# EAGLE design scu_board (EAGLE 9.3.0)
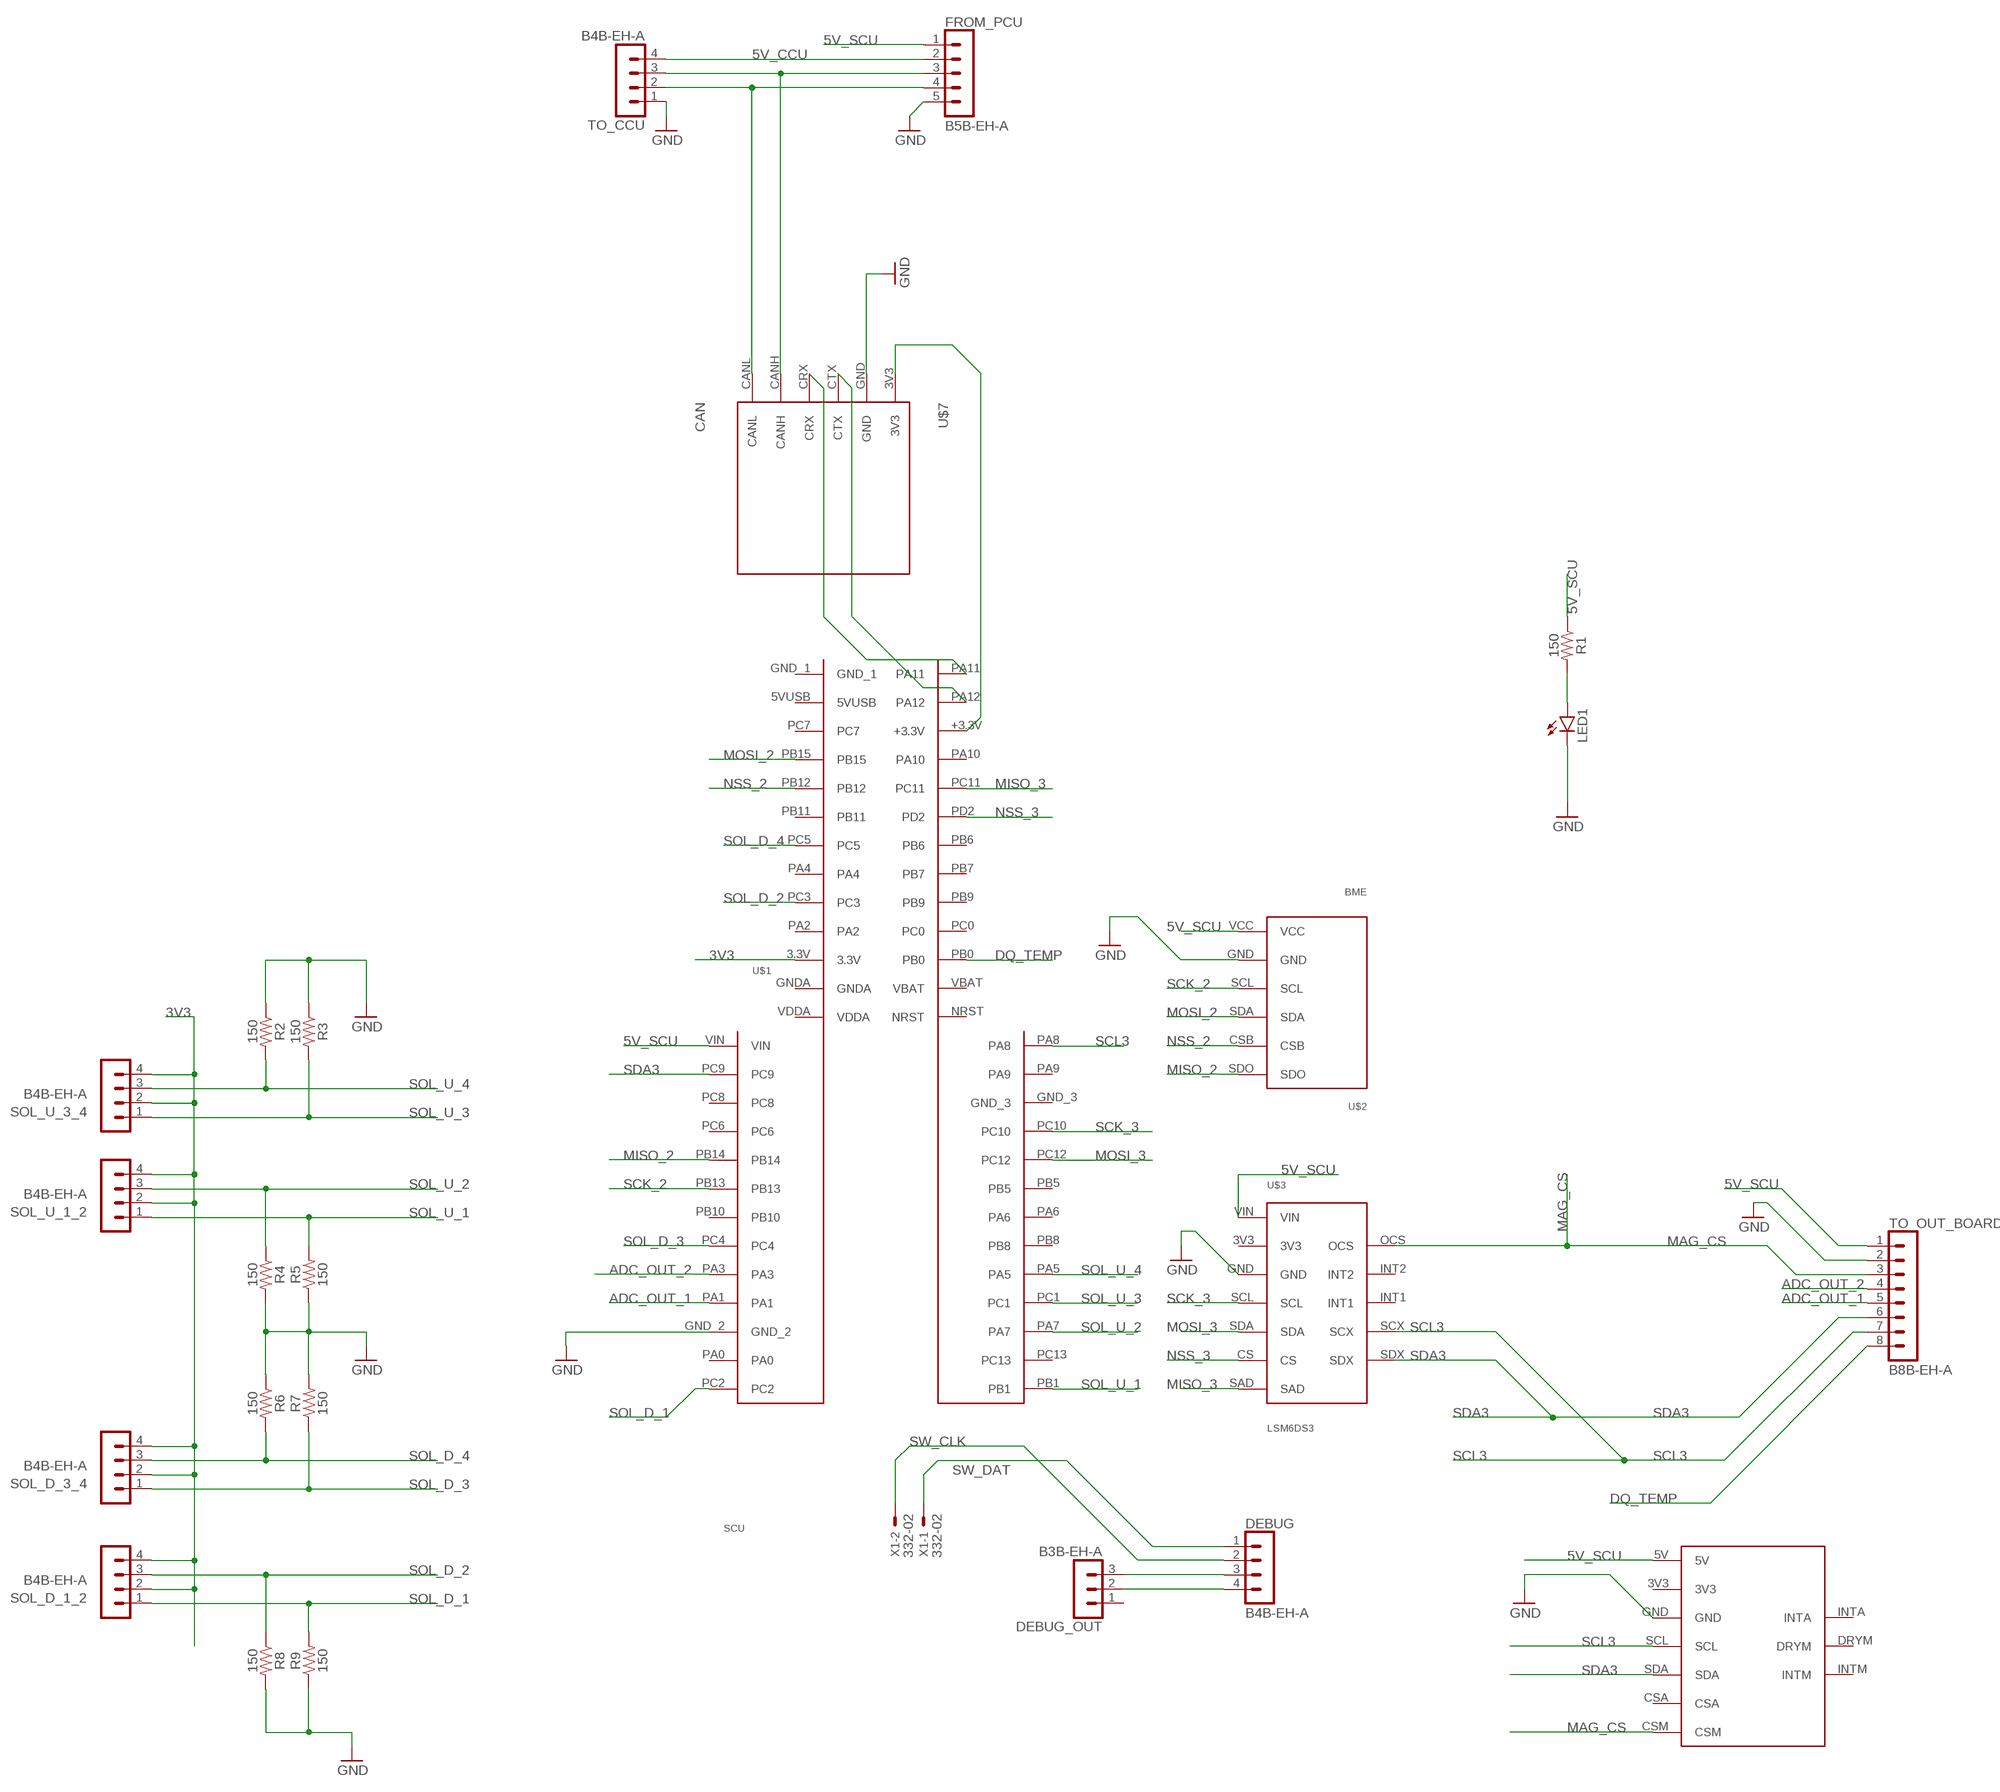
[diagram p0: schematic, sheet 1]

## Parts
DEBUG  B4B-EH-A  [B4B-EH-A]
DEBUG_OUT  B3B-EH-A  [B3B-EH-A]
FROM_PCU  B5B-EH-A  [B5B-EH-A]
LED1  LED5MM  [LED5MM]
R1  150  RESISTORAXIAL-0.3  [AXIAL-0.3]
R2  150  RESISTORAXIAL-0.3  [AXIAL-0.3]
R3  150  RESISTORAXIAL-0.3  [AXIAL-0.3]
R4  150  RESISTORAXIAL-0.3  [AXIAL-0.3]
R5  150  RESISTORAXIAL-0.3  [AXIAL-0.3]
R6  150  RESISTORAXIAL-0.3  [AXIAL-0.3]
R7  150  RESISTORAXIAL-0.3  [AXIAL-0.3]
R8  150  RESISTORAXIAL-0.3  [AXIAL-0.3]
R9  150  RESISTORAXIAL-0.3  [AXIAL-0.3]
SOL_D_1_2  B4B-EH-A  [B4B-EH-A]
SOL_D_3_4  B4B-EH-A  [B4B-EH-A]
SOL_U_1_2  B4B-EH-A  [B4B-EH-A]
SOL_U_3_4  B4B-EH-A  [B4B-EH-A]
TO_CCU  B4B-EH-A  [B4B-EH-A]
TO_OUT_BOARD  B8B-EH-A  [B8B-EH-A]
U$1  SCU  [SCU]
U$2  BME  [BME]
U$3  LSM6DS3  [LSM6DS3]
U$4  LSM303C  [LSM303C]
U$7  CAN  [CAN]
X1  332-02  [332-02]

## Nets
3V3: SOL_D_1_2.2 SOL_D_1_2.4 SOL_D_3_4.2 SOL_D_3_4.4 SOL_U_1_2.2 SOL_U_1_2.4 SOL_U_3_4.2 SOL_U_3_4.4 U$1.3.3V
5V_CCU: FROM_PCU.2 TO_CCU.4
5V_SCU: FROM_PCU.1 R1.P$1 TO_OUT_BOARD.1 U$1.VIN U$2.VCC U$3.VIN U$4.5V
ADC_OUT_1: TO_OUT_BOARD.5 U$1.PA1
ADC_OUT_2: TO_OUT_BOARD.4 U$1.PA3
DQ_TEMP: TO_OUT_BOARD.8 U$1.PB0
GND: FROM_PCU.5 LED1.K(C) R2.P$1 R3.P$1 R4.P$2 R5.P$1 R6.P$1 R7.P$2 R8.P$2 R9.P$1 TO_CCU.1 TO_OUT_BOARD.2 U$1.GND_2 U$2.GND U$3.GND U$4.GND U$7.GND
MAG_CS: TO_OUT_BOARD.3 U$3.OCS U$4.CSM
MISO_2: U$1.PB14 U$2.SDO
MISO_3: U$1.PC11 U$3.SAD
MOSI_2: U$1.PB15 U$2.SDA
MOSI_3: U$1.PC12 U$3.SDA
N$6: U$1.PA11 U$7.CRX
N$7: U$1.PA12 U$7.CTX
N$16: U$1.+3.3V U$7.3V3
N$19: LED1.A R1.P$2
N$23: FROM_PCU.3 TO_CCU.3 U$7.CANH
N$25: FROM_PCU.4 TO_CCU.2 U$7.CANL
N$26: DEBUG.3 DEBUG_OUT.3
N$27: DEBUG.4 DEBUG_OUT.2
NSS_2: U$1.PB12 U$2.CSB
NSS_3: U$1.PD2 U$3.CS
SCK_2: U$1.PB13 U$2.SCL
SCK_3: U$1.PC10 U$3.SCL
SCL3: TO_OUT_BOARD.7 U$1.PA8 U$3.SCX U$4.SCL
SDA3: TO_OUT_BOARD.6 U$1.PC9 U$3.SDX U$4.SDA
SOL_D_1: R9.P$2 SOL_D_1_2.1 U$1.PC2
SOL_D_2: R8.P$1 SOL_D_1_2.3 U$1.PC3
SOL_D_3: R7.P$1 SOL_D_3_4.1 U$1.PC4
SOL_D_4: R6.P$2 SOL_D_3_4.3 U$1.PC5
SOL_U_1: R5.P$2 SOL_U_1_2.1 U$1.PB1
SOL_U_2: R4.P$1 SOL_U_1_2.3 U$1.PA7
SOL_U_3: R3.P$2 SOL_U_3_4.1 U$1.PC1
SOL_U_4: R2.P$2 SOL_U_3_4.3 U$1.PA5
SW_CLK: DEBUG.2 X1.2
SW_DAT: DEBUG.1 X1.1
Unconnected: DEBUG_OUT.1 U$1.5VUSB U$1.GND_1 U$1.GND_3 U$1.GNDA U$1.NRST U$1.PA0 U$1.PA2 U$1.PA4 U$1.PA6 U$1.PA9 U$1.PA10 U$1.PB5 U$1.PB6 U$1.PB7 U$1.PB8 U$1.PB9 U$1.PB10 U$1.PB11 U$1.PC0 U$1.PC6 U$1.PC7 U$1.PC8 U$1.PC13 U$1.VBAT U$1.VDDA U$3.3V3 U$3.INT1 U$3.INT2 U$4.3V3 U$4.CSA U$4.DRYM U$4.INTA U$4.INTM

## Library data of the parts
DEBUG SOL_D_1_2 SOL_D_3_4 SOL_U_1_2 SOL_U_3_4 TO_CCU = con-jst-eh:B4B-EH-A: HEADER
DEBUG_OUT = con-jst-eh:B3B-EH-A: HEADER
FROM_PCU = con-jst-eh:B5B-EH-A: HEADER
LED1 = led:LED: LED OSRAM: - CHIPLED LG R971, LG N971, LY N971, LG Q971, LY Q971, LO R971, LY R971 LH N974, LH R974 LS Q976, LO Q976, LY Q976 LO Q996 - Hyper CHIPLED LW Q18S LB Q993, LB Q99A, LB R99A - SideLED LS A670, LO A670, LY A670, LG A670, LP A670 LB A673, LV A673, LT A673, LW A673 LH A674 LY A675 LS A676, LA A676, LO A676, LY A676, LW A676 LS A679, LY A679, LG A679 - Hyper Micro SIDELED® LS Y876, LA Y876, LO Y876, LY Y876 LT Y87S - SmartLED LW L88C, LW L88S LB L89C, LB L89S, LG L890 LS L89K, LO L89K, LY L89K LS L896, LA L896, LO L896, LY L896 - TOPLED LS T670, LO T670, LY T670, LG T670, LP T670 LSG T670, LSP T670, LSY T670, LOP T670, LYG T670 LG T671, LOG T671, LSG T671 LB T673, LV T673, LT T673, LW T673 LH T674 LS T676, LA T676, LO T676, LY T676, LB T676, LH T676, LSB T676, LW T676 LB T67C, LV T67C, LT T67C, LS T67K, LO T67K, LY T67K, LW E67C LS E67B, LA E67B, LO E67B, LY E67B, LB E67C, LV E67C, LT E67C LW T67C LS T679, LY T679, LG T679 LS T770, LO T770, LY T770, LG T770, LP T770 LB T773, LV T773, LT T773, LW T773 LH T774 LS E675, LA E675, LY E675, LS T675 LS T776, LA T776, LO T776, LY T776, LB T776 LHGB T686 LT T68C, LB T68C - Hyper Mini TOPLED® LB M676 - Mini TOPLED Santana® LG M470 LS M47K, LO M47K, LY M47K Source: http://www.osram.convergy.de LUXEON: - LUMILED® LXK2-PW12-R00, LXK2-PW12-S00, LXK2-PW14-U00, LXK2-PW14-V00 LXK2-PM12-R00, LXK2-PM12-S00, LXK2-PM14-U00 LXK2-PE12-Q00, LXK2-PE12-R00, LXK2-PE12-S00, LXK2-PE14-T00, LXK2-PE14-U00 LXK2-PB12-K00, LXK2-PB12-L00, LXK2-PB12-M00, LXK2-PB14-N00, LXK2-PB14-P00, LXK2-PB14-Q00 LXK2-PR12-L00, LXK2-PR12-M00, LXK2-PR14-Q00, LXK2-PR14-R00 LXK2-PD12-Q00, LXK2-PD12-R00, LXK2-PD12-S00 LXK2-PH12-R00, LXK2-PH12-S00 LXK2-PL12-P00, LXK2-PL12-Q00, LXK2-PL12-R00 Source: www.luxeon.com KINGBRIGHT: KA-3528ASYC Source: www.kingbright.com
R1-R9 = SparkFun-Resistors:RESISTOR: Generic Resistor Package
TO_OUT_BOARD = con-jst-eh:B8B-EH-A: HEADER
U$1 = bluepill:SCU
U$2 = bluepill:BME
U$3 = bluepill:LSM6DS3: lsm
U$4 = bluepill:LSM303C
U$7 = bluepill:CAN
X1 = con-garry:332-02: 2 Pin - 2mm Dual Row Source: www.mpe-connector.de / garry_shortform_2012.pdf

## Board
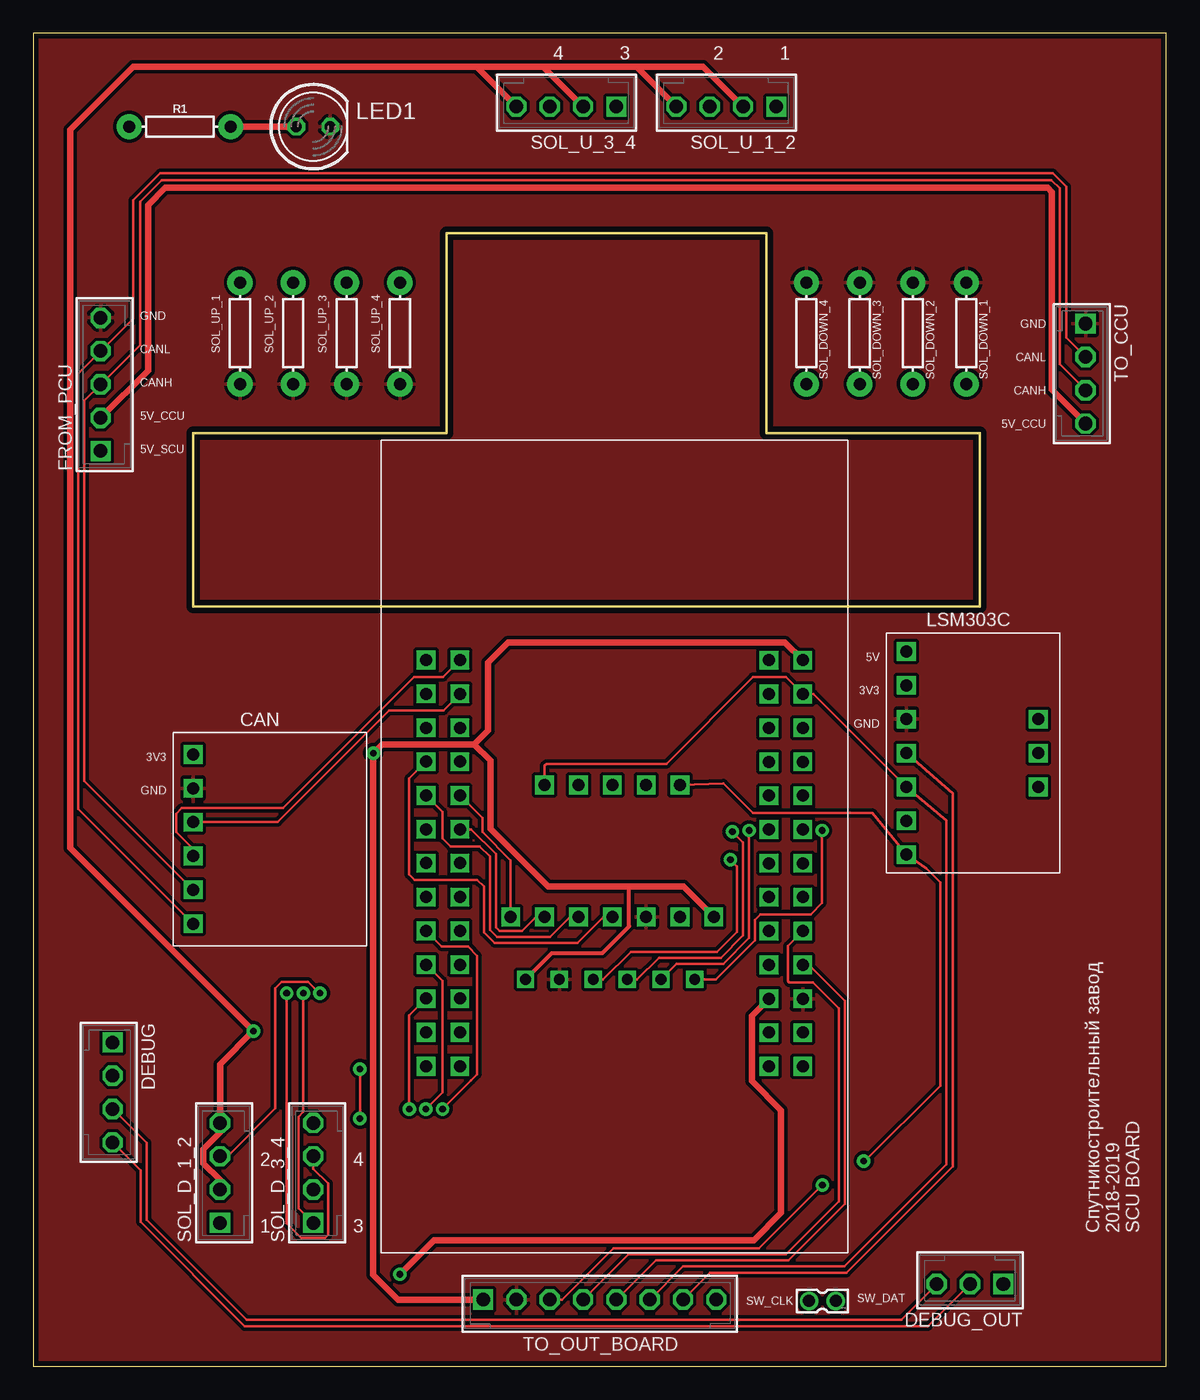
[diagram p1: board, top side]
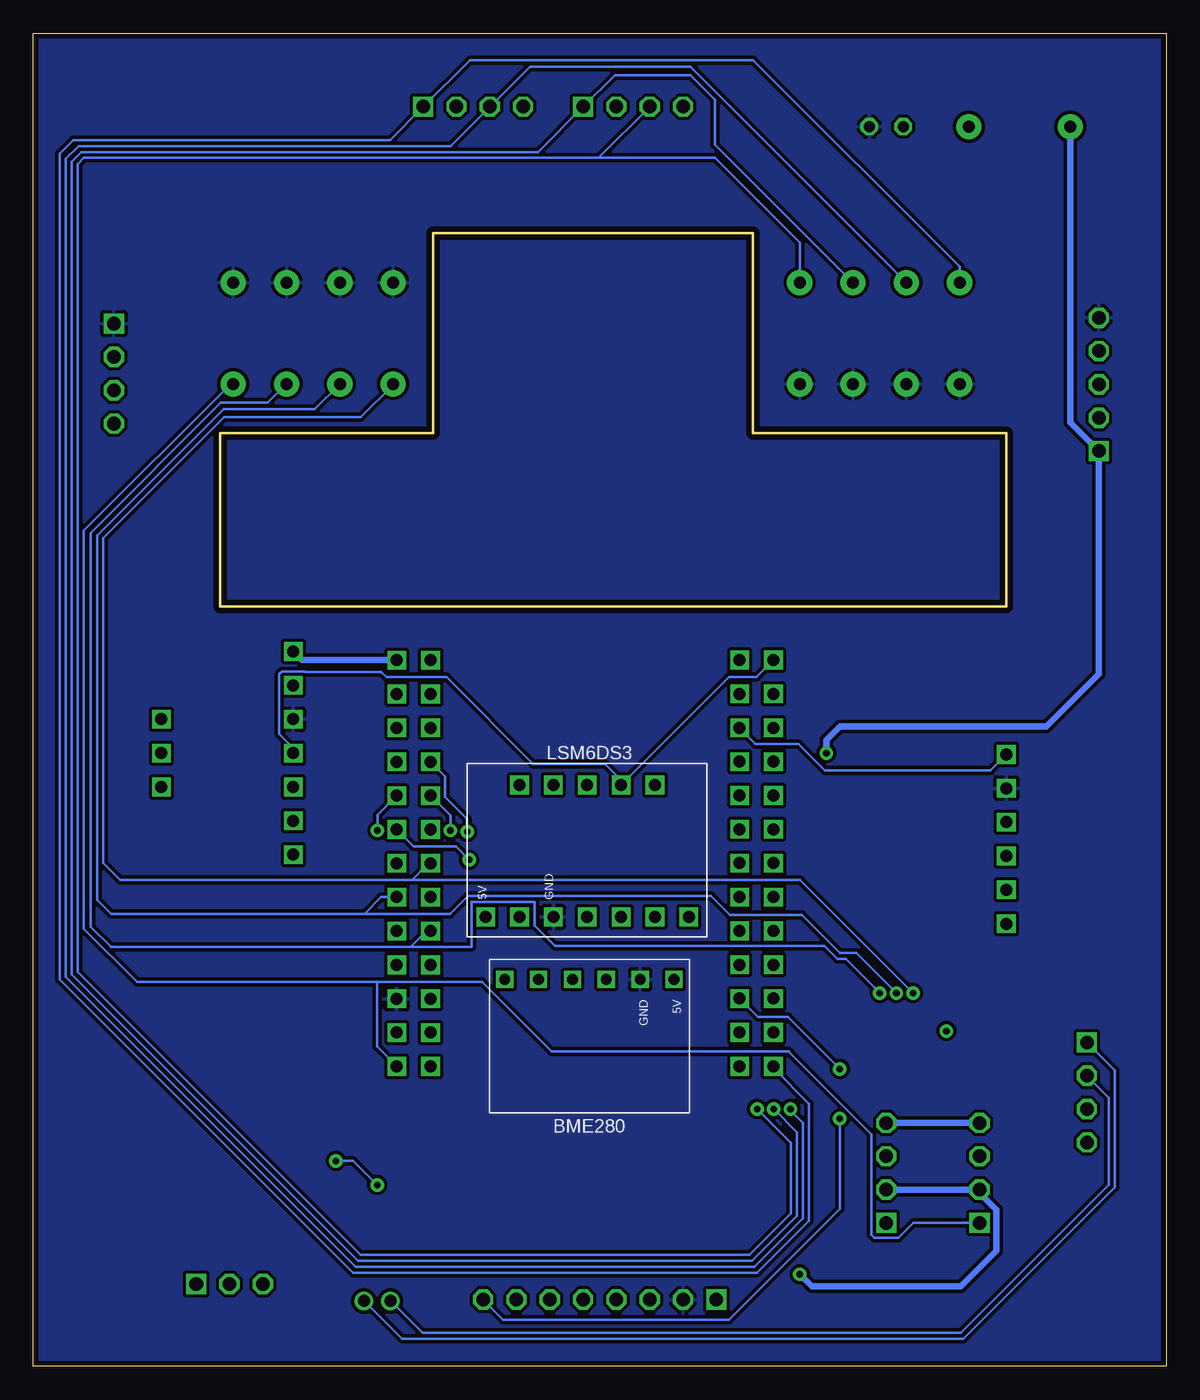
[diagram p2: board, bottom side, seen from below]

Size 85 x 100 mm. Coordinates in mm from the lower left corner, seen from the top.
Outline: 0,0 85,0 85,100 0,100 0,0
Outline: 55,85 31,85 31,70 12,70 12,57 71,57 71,70 55,70 55,85
Copper layers (1*16): Top 0.035mm / dielectric 1mm / Bottom 0.035mm
Design rules "rezonit": minimum track width 0.2mm, minimum drill 0.5mm, track to track 0.25mm, track to pad 0.25mm, pad to pad 0.25mm, via to via 0.25mm, smd to smd 0.2mm, copper to edge 0.4mm, drill to drill 0.4mm, minimum pad ring 0.25mm, minimum via ring 0.25mm, stop-mask expansion 4mil, vias tented up to drill 0.6mm, thermal gap 10mil

### Footprints (pad centres in the part's own frame; a part is rotated, then mirrored left to right if it is on the bottom)
B4B-EH-A = drill 1.016 square: 1 -3.75,0 | drill 1.016 octagon: 2 -1.25,0; 3 1.25,0; 4 3.75,0
B3B-EH-A = drill 1.016 square: 1 -2.5,0 | drill 1.016 octagon: 2 0,0; 3 2.5,0
B5B-EH-A = drill 1.016 square: 1 -5,0 | drill 1.016 octagon: 2 -2.5,0; 3 0,0; 4 2.5,0; 5 5,0
LED5MM = drill 0.813 octagon: A -1.27,0; K 1.27,0
AXIAL-0.3 = drill 0.9 pad 1.88: P$1 -3.81,0; P$2 3.81,0
B8B-EH-A = drill 1.016 square: 1 -8.75,0 | drill 1.016 octagon: 2 -6.25,0; 3 -3.75,0; 4 -1.25,0; 5 1.25,0; 6 3.75,0; 7 6.25,0; 8 8.75,0
SCU = drill 0.9 square: 3.3V 11.59,-11.43; 5VUSB 11.59,11.43; +3.3V -11.59,8.9; GND_1 11.59,13.97; GND_2 14.13,-11.43; GND_3 -14.13,8.9; GNDA 11.59,-13.97; NRST -11.59,-16.5; PA0 14.13,-13.97; PA1 14.13,-8.89; PA2 11.59,-8.89; PA3 14.13,-6.35; PA4 11.59,-3.81; PA5 -14.13,-6.34; PA6 -14.13,-1.26; PA7 -14.13,-11.42; PA8 -14.13,13.98; PA9 -14.13,11.44; PA10 -11.59,6.36; PA11 -11.59,13.98; PA12 -11.59,11.44; PB0 -11.59,-11.42; PB1 -14.13,-16.5; PB5 -14.13,1.28; PB6 -11.59,-1.26; PB7 -11.59,-3.8; PB8 -14.13,-3.8; PB9 -11.59,-6.34; PB10 14.13,-1.27; PB11 11.59,1.27; PB12 11.59,3.81; PB13 14.13,1.27; PB14 14.13,3.81; PB15 11.59,6.35; PC0 -11.59,-8.88; PC1 -14.13,-8.88; PC2 14.13,-16.51; PC3 11.59,-6.35; PC4 14.13,-3.81; PC5 11.59,-1.27; PC6 14.13,6.35; PC7 11.59,8.89; PC8 14.13,8.89; PC9 14.13,11.43; PC10 -14.13,6.36; PC11 -11.59,3.82; PC12 -14.13,3.82; PC13 -14.13,-13.96; PD2 -11.59,1.28; VBAT -11.59,-13.96; VDDA 11.59,-16.51; VIN 14.13,13.97
BME = drill 0.8 square: CSB 4.25,3.81; GND 4.25,-3.81; SCL 4.25,-1.27; SDA 4.25,1.27; SDO 4.25,6.35; VCC 4.25,-6.35
LSM6DS3 = drill 0.9 square: 3V3 -5,5.08; CS -5,-5.08; GND -5,2.54; INT1 4.9,0; INT2 4.9,2.54; OCS 4.9,5.08; SAD -5,-7.62; SCL -5,0; SCX 4.9,-2.54; SDA -5,-2.54; SDX 4.9,-5.08; VIN -5,7.62
LSM303C = drill 0.9 square: 3V3 -5,5.08; 5V -5,7.62; CSA -5,-5.08; CSM -5,-7.62; DRYM 4.9,0; GND -5,2.54; INTA 4.9,2.54; INTM 4.9,-2.54; SCL -5,0; SDA -5,-2.54
CAN = drill 0.9 square: 3V3 -5.75,6.35; CANH -5.75,-3.81; CANL -5.75,-6.35; CRX -5.75,-1.27; CTX -5.75,1.27; GND -5.75,3.81
332-02 = drill 0.9 pad 1.27: 1 0,-1; 2 0,1

### Placement (x,y rotation side)
DEBUG  5.95,20.54 270 top
DEBUG_OUT  70.28,6.16 180 top
FROM_PCU  5.05,73.66 90 top
LED1  21,93 0 top
R1  11,93 0 top
R2  27.5,77.5 90 top
R3  23.5,77.5 90 top
R4  19.5,77.5 270 top
R5  15.5,77.5 90 top
R6  58,77.5 270 top
R7  62,77.5 90 top
R8  66,77.5 90 top
R9  70,77.5 270 top
SOL_D_1_2  14,14.5 90 top
SOL_D_3_4  21,14.5 90 top
SOL_U_1_2  52,94.5 180 top
SOL_U_3_4  40,94.5 180 top
TO_CCU  78.95,74.47 270 top
TO_OUT_BOARD  42.5,5 0 top
U$1  43.6,39 0 top
U$2  43.28,24.77 90 bottom
U$3  43.44,38.71 90 bottom
U$4  70.5,46 0 top
U$7  17.74,39.55 0 top
X1  59.2,4.9 90 top

### Tracks (layer width: path | path; a pad name or v marks a point on that pad's centre or on a via)
3V3  (via drill 0.5)
  Top 0.5: 33.25,97.5 7.5,97.5 2.77,92.78 2.77,38.87 v16.5,25.14 14,22.64 SOL_D_1_2.4 14,17.54 12.74,16.27 12.74,15.23 14,13.96 SOL_D_1_2.2 | 33.25,97.5 38.25,97.5 | 38.25,97.5 45.25,97.5 | 45.25,97.5 50.25,97.5 SOL_U_1_2.2 | SOL_U_3_4.4 33.25,97.5 | SOL_U_3_4.2 38.25,97.5 | SOL_U_1_2.4 45.25,97.5 | v27.5,6.9 30.05,9.45 54.05,9.45 56.1,11.5 56.1,19.2 53.9,21.4 53.9,26.28 U$1.3.3V
  Bottom 0.5: SOL_D_1_2.4 SOL_D_3_4.4 | SOL_D_3_4.2 SOL_D_1_2.2 14,12.98 12.74,11.72 12.74,8.66 15.4,6 26.6,6 v27.5,6.9
5V_CCU
  Top 0.5: FROM_PCU.2 8.6,74.71 8.6,87.11 9.88,88.4 76.1,88.4 76.4,88.1 76.4,73.27 TO_CCU.4
5V_SCU  (via drill 0.5)
  Top 0.3: U$2.VCC 38.91,31 42.7,31 44.7,33 44.7,35.9 44.8,36
  Top 0.5: U$3.VIN 48.77,36 44.8,36 38.61,36 34.29,40.32 34.29,45.45 33.08,46.66 | 33.08,46.66 26.16,46.66 v25.5,46 25.5,6.85 27.35,5 TO_OUT_BOARD.1 | U$1.VIN 56.4,54.3 35.6,54.3 34.1,52.8 34.1,47.68 33.08,46.66
  Bottom 0.5: R1.P$1 7.19,70.8 FROM_PCU.1 5.05,51.95 9,48 24.49,48 25.5,46.99 v25.5,46 | U$4.5V 64.85,52.97 U$1.VIN
ADC_OUT_1
  Top 0.2: TO_OUT_BOARD.5 46.7,7.95 56.65,7.95 60.9,12.2 60.9,27.4 58.19,30.11 U$1.PA1
ADC_OUT_2
  Top 0.2: TO_OUT_BOARD.4 44.65,8.4 56.46,8.4 60.45,12.39 60.45,26.85 58.5,28.8 56.7,28.8 56.6,28.9 56.6,31.52 U$1.PA3
DQ_TEMP  (via drill 0.5)
  Top 0.2: v24.5,18.57 v24.5,22.3
  Bottom 0.2: TO_OUT_BOARD.8 49.75,3.5 32.8,3.5 24.5,11.8 v24.5,18.57 | v24.5,22.3 28.4,26.2 30.63,26.2 U$1.PB0
GND
  pour Bottom: 0,100 0,0 85,0 85,100
  pour Top: 0,100 0,0 85,0 85,100
MAG_CS  (via drill 0.5)
  Top 0.2: U$3.OCS 51.79,43.71 54,41.5 62.95,41.5 U$4.CSM 67,37.36 68.05,36.31 68.05,21.05 62.4,15.4 v62.3,15.4 | TO_OUT_BOARD.3 39.68,5 43.53,8.85 54.45,8.85 v59.2,13.6
  Bottom 0.2: v59.2,13.6 61,15.4 v62.3,15.4
MISO_2  (via drill 0.5)
  Top 0.2: U$2.SDO 51.22,29.02 54.14,31.94 54.14,33.49 54.55,33.9 58.34,33.9 59.18,34.74 v59.18,40.2
  Bottom 0.2: v59.18,40.2 59.18,41.36 U$1.PB14
MISO_3
  Top 0.2: U$3.SAD 35.82,37.94 33.69,40.07 33.69,41.14 U$1.PC11
MOSI_2  (via drill 0.5)
  Top 0.2: U$2.SDA 45.3,29.02 46.92,30.65 51.58,30.65 53.24,32.31 53.24,39.31 v52.45,40.1
  Bottom 0.2: v52.45,40.1 52.45,41.05 54.1,42.7 54.1,44.26 U$1.PB15
MOSI_3
  Top 0.2: U$3.SDA 40.26,33.71 38.76,32.21 34.79,32.21 34.25,32.75 34.25,38.24 33.49,39 31.3,39 30.7,39.6 30.7,41.59 U$1.PC12
N$6
  Top 0.2: U$7.CRX 11.99,38.81 10.7,40.1 10.7,41.42 11.14,41.87 18.73,41.87 28.56,51.7 30.73,51.7 U$1.PA11
N$7
  Top 0.2: U$7.CTX 18.32,40.82 26.7,49.2 30.77,49.2 U$1.PA12
N$16
  Bottom 0.2: U$1.+3.3V 30.81,46.7 27.6,46.7 25.6,44.7 13.19,44.7 U$7.3V3
N$19
  Top 0.5: R1.P$2 LED1.A
N$23
  Top 0.2: TO_CCU.3 77,75.17 77,88.36 76.36,89 9.64,89 8,87.36 8,76.61 FROM_PCU.3 3.83,72.44 3.83,43.91 U$7.CANH
N$25
  Top 0.2: TO_CCU.2 77.5,77.17 77.5,88.5 76.5,89.5 9.5,89.5 7.5,87.5 7.5,78.61 FROM_PCU.4 3.38,74.48 3.38,41.81 U$7.CANL
N$26
  Top 0.2: DEBUG_OUT.3 65.12,3.5 16,3.5 8.5,11 8.5,16.74 DEBUG.3
N$27
  Top 0.2: DEBUG_OUT.2 67.12,3 15.86,3 8.05,10.81 8.05,14.69 DEBUG.4
NSS_2  (via drill 0.5)
  Top 0.2: U$2.CSB 48.27,30.2 51.76,30.2 53.69,32.13 53.69,35.5 53.69,35.59 v53.69,40.19 v53.7,40.2
  Bottom 0.2: v53.7,40.2 53.7,41.32 U$1.PB12
NSS_3
  Top 0.2: U$3.CS 37.72,33.71 36.66,32.66 34.98,32.66 34.7,32.94 34.7,38.42 32.84,40.28 U$1.PD2
SCK_2  (via drill 0.5)
  Top 0.2: U$2.SCL 42.76,29.02 44.84,31.1 51.3,31.1 52.79,32.59 52.79,37.51 v52.3,38
  Bottom 0.2: v52.3,38 53.3,39 56.46,39 U$1.PB13
SCK_3
  Top 0.2: U$3.SCL 42.8,33.71 40.84,31.76 34.6,31.76 33.8,32.56 33.8,36 33.3,36.5 28.6,36.5 28.2,36.9 28.2,44.09 U$1.PC10
SCL3
  Top 0.2: TO_OUT_BOARD.7 50.75,7 61,7 69,15 69,42.98 U$4.SCL
  Bottom 0.2: U$4.SCL 65.5,46.4 66.55,47.45 66.55,51.92 66.34,52.13 64.66,52.13 64.62,52.1 58.9,52.1 58.5,51.7 54,51.7 47.5,45.2 42.1,45.2 40.9,44 U$3.SCX 32.81,51.7 30.75,51.7 U$1.PA8
SDA3
  Top 0.2: TO_OUT_BOARD.6 48.75,7.5 60.86,7.5 68.5,15.14 68.5,40.94 U$4.SDA | 65.26,43.5 U$4.SDA | U$4.SDA 58.53,50.43 U$1.PC9 56.46,51.7 54,51.7 47.5,45.2 38.5,45.2 38.36,45.06 U$3.SDX
SOL_D_1
  Bottom 0.2: SOL_D_1_2.1 18.98,10.75 20.09,9.64 21.91,9.64 22.11,9.84 22.11,17.39 28.32,23.6 28.32,23.62 46.12,23.62 51.35,28.85 59.23,28.85 | 59.23,28.85 77.22,28.85 81.2,32.83 81.2,62.69 70.2,73.69 R9.P$2 | 59.23,28.85 59.23,23.98 U$1.PC2
SOL_D_2  (via drill 0.5)
  Top 0.2: SOL_D_1_2.3 14.57,15.75 18.15,19.33 18.15,28.35 18.65,28.85 20.6,28.85 21.45,28 v21.5,28
  Bottom 0.2: v21.5,28 24.05,30.55 24.69,30.55 25.66,31.52 45.85,31.52 47.4,33.08 47.4,34.85 52.12,34.85 52.12,31.45 56.7,31.45 | R8.P$1 67.4,72.29 70.94,72.29 80.7,62.52 80.7,32.98 79.17,31.45 56.7,31.45 | 56.7,31.45 55.5,32.65 U$1.PC3
SOL_D_3  (via drill 0.5)
  Top 0.2: v20.25,28 20.25,19.07 19.89,18.71 19.89,11.86 SOL_D_3_4.1
  Bottom 0.2: v20.25,28 23.25,31 24.5,31 27.35,33.85 32.71,33.85 34.16,35.3 52.4,35.3 53.75,33.95 60.15,33.95 | R7.P$1 63.9,71.79 70.73,71.79 80.2,62.33 80.2,35 79.15,33.95 60.15,33.95 | 60.15,33.95 58.91,35.19 U$1.PC4
SOL_D_4  (via drill 0.5)
  Top 0.2: SOL_D_3_4.3 21,14.82 22.11,13.71 22.11,9.84 21.91,9.64 20.09,9.64 19,10.73 v19,28
  Bottom 0.2: v19,28 27.5,36.5 56.6,36.5 | R6.P$2 58,73.62 60.43,71.19 70.69,71.19 79.75,62.14 79.75,37.75 78.5,36.5 56.6,36.5 | 56.6,36.5 55.37,37.73 U$1.PC5
SOL_U_1
  Bottom 0.2: R5.P$2 15.5,82.5 31,98 52.25,98 SOL_U_1_2.1 58.25,92 82,92 83.03,90.97 83.03,29.02 61.01,7 30.7,7 26.8,10.9 26.8,19.7 29.47,22.37 U$1.PB1
SOL_U_2  (via drill 0.5)
  Top 0.2: v28.2,19.3 28.2,26.31 U$1.PA7
  Bottom 0.2: R4.P$1 35.69,97.5 47.75,97.5 SOL_U_1_2.3 53.7,91.55 81.6,91.55 82.58,90.58 82.58,29.2 60.82,7.45 30.9,7.45 27.25,11.1 27.25,18.25 28.2,19.2 v28.2,19.3
SOL_U_3  (via drill 0.5)
  Top 0.2: v29.45,19.3 30.7,20.55 30.7,28.89 U$1.PC1
  Bottom 0.2: R3.P$2 33.84,91.66 33.84,95.02 35.7,96.88 41.38,96.88 SOL_U_3_4.1 47.15,91.1 81.4,91.1 82.12,90.38 82.12,29.39 60.64,7.9 31.09,7.9 27.7,11.29 27.7,17.55 v29.45,19.3
SOL_U_4  (via drill 0.5)
  Top 0.2: v30.7,19.3 32.85,21.45 33.3,21.89 33.3,30.8 32.6,31.5 30.63,31.5 U$1.PA5
  Bottom 0.2: 42.6,90.65 81.21,90.65 81.67,90.19 81.67,29.57 60.45,8.35 31.27,8.35 28.15,11.47 28.15,16.75 v30.7,19.3 | SOL_U_3_4.3 42.6,90.65 | R2.P$2 27.5,84.31 33.84,90.65 42.6,90.65
SW_CLK
  Bottom 0.2: DEBUG.2 4.3,20.14 4.3,13.6 15.4,2.5 55.8,2.5 X1.2
SW_DAT
  Bottom 0.2: DEBUG.1 3.85,22.19 3.85,13.41 15.21,2.05 57.35,2.05 X1.1

### Text on the board
tPlace: 4 | 3 | 2 | 1 | SOL_DOWN_4 | SOL_DOWN_3 | SOL_DOWN_2 | SOL_DOWN_1 | GND | GND | CANL | SOL_UP_1 | SOL_UP_2 | SOL_UP_3 | SOL_UP_4 | CANL | CANH | CANH | 5V_CCU | 5V_CCU | 5V_SCU | LSM303C | 5V | 3V3 | CAN | GND | 3V3 | GND | 2 | 4 | 1 | 3 | Спутникостроительный завод / 2018-2019 / SCU BOARD | SW_CLK | SW_DAT
bPlace: LSM6DS3 | GND | 5V | 5V | GND | BME280